# Altium schematic sheet Audio_Codecs_v1.SchDoc
size A4; SheetNumber: 2; SheetTotal: 13
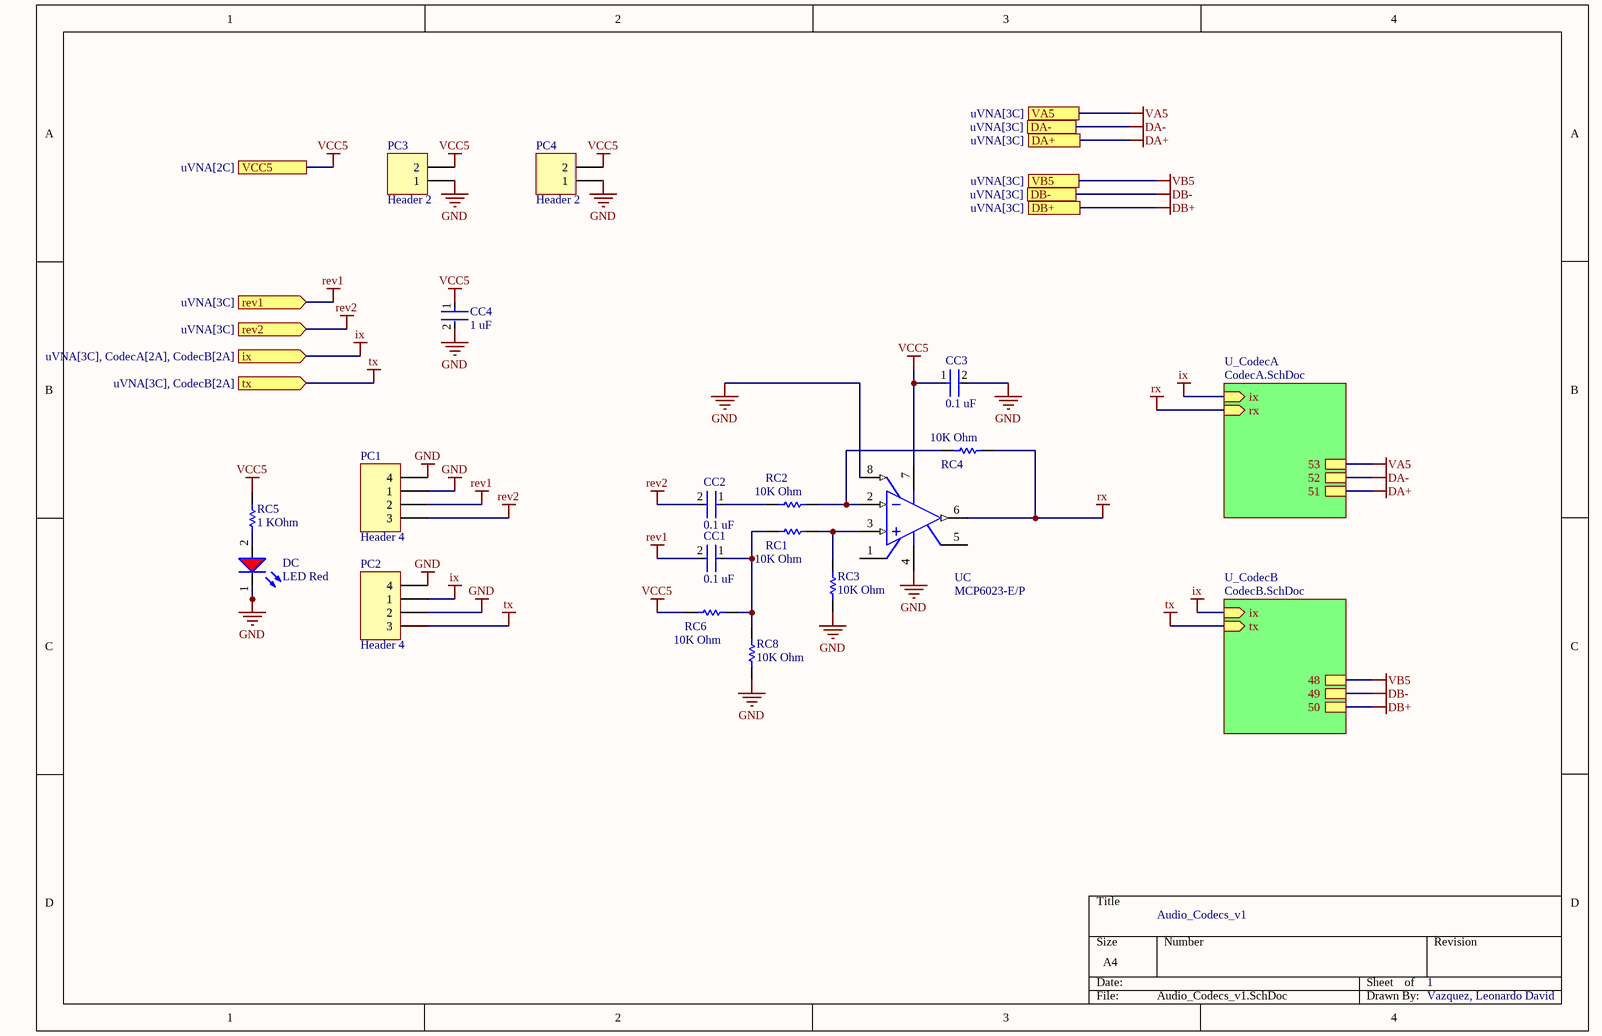
[diagram p0: Audio_Codecs_v1.SchDoc]

## Parts
CC1  0.1 uF  [FP-CC0805-0_85-MFG]
CC2  0.1 uF  [FP-CC0805-0_85-MFG]
CC3  0.1 uF  [FP-CC0805-0_85-MFG]
CC4  1 uF  [FP-CC0805-0_85-MFG]
DC  LED Red  [WL-SMCW_0805_150080xx75000]
PC1  Header 4  [HDR1X4]
PC2  Header 4  [HDR1X4]
PC3  Header 2  [HDR1X2]
PC4  Header 2  [HDR1X2]
RC1  10K Ohm  [RESC2013X60X40ML20T25]
RC2  10K Ohm  [RESC2013X60X40ML20T25]
RC3  10K Ohm  [RESC2013X60X40ML20T25]
RC4  10K Ohm  [RESC2013X60X40ML20T25]
RC5  1 KOhm  [RESC2013X60X40ML20T25]
RC6  10K Ohm  [RESC2013X60X40ML20T25]
RC8  10K Ohm  [RESC2013X60X40ML20T25]
UC  MCP6023-E/P  [PDIP300-P8]

## Sub-sheets
U_CodecA = CodecA.SchDoc: ix (in), rx (in), 51, 52, 53
U_CodecB = CodecB.SchDoc: ix (in), tx (in), 48, 49, 50

## Ports
DA+ (see uVNA[3C]), DA- (see uVNA[3C]), DB+ (see uVNA[3C]), DB- (see uVNA[3C]), ix (in, see uVNA[3C], CodecA[2A], CodecB[2A]), rev1 (in, see uVNA[3C]), rev2 (in, see uVNA[3C]), tx (in, see uVNA[3C], CodecB[2A]), VA5 (see uVNA[3C]), VB5 (see uVNA[3C]), VCC5 (see uVNA[2C])

## Nets
DA+: port DA+, sheet U_CodecA/51
DA-: port DA-, sheet U_CodecA/52
DB+: port DB+, sheet U_CodecB/50
DB-: port DB-, sheet U_CodecB/49
GND: CC3.2 CC4.2 DC.1(K) PC1.1 PC1.4 PC2.2 PC2.4 PC3.1 PC4.1 RC3.2 RC8.2 UC.4(VSS) UC.8(~{CS})
ix: PC2.1 ; port ix, sheet U_CodecA/ix, sheet U_CodecB/ix
rev1: CC1.2 PC1.2 ; port rev1
rev2: CC2.2 PC1.3 ; port rev2
rx: RC4.1 UC.6(VOUT) ; sheet U_CodecA/rx
tx: PC2.3 ; port tx, sheet U_CodecB/tx
VA5: port VA5, sheet U_CodecA/53
VB5: port VB5, sheet U_CodecB/48
VCC5: CC3.1 CC4.1 PC3.2 PC4.2 RC5.2 RC6.2 UC.7(VDD) ; port VCC5
NetCC1_1: CC1.1 RC1.2 RC6.1 RC8.1
NetCC2_1: CC2.1 RC2.2
NetDC_2: DC.2(A) RC5.1
NetRC1_1: RC1.1 RC3.1 UC.3(VIN+)
NetRC2_1: RC2.1 RC4.2 UC.2(VIN-)

Not connected (* = marked no-connect by the designer): UC 1(NC) 5(VREF)

## Notes on the sheet
- Audio_Codecs_v1
- 1
- Vazquez, Leonardo David

## Library data of the parts
CC1-CC4 = CMP-2100-03606-3: CAP CER 0.1UF 50V X7R 0805; Manufacturer Part Number: CC0805KRX7R9BB104; Manufacturer: Yageo; Tolerance: 0.1; Capacitance: 100 nF; Value: 100 nF; Device Class L1: Passive Components; ComponentLink2Description: Datasheet; Package: CC0805-0.85; Digikey Description: CAP CER 0.1UF 50V X7R 0805; Device Class L3: Ceramic Capacitors; Temperature: -30°C to +85°C; Temperature Characteristic: X7R; Voltage Rating: 50 V; Height: 0.95mm; RoHS: TRUE; Ipc Land Pattern Name: CAPC200125X85; Device Class L2: Capacitors; Category: Cap; Temperature Range Low: -30°C; Temperature Range High: +85°C; Material: Ceramic; Mouser Description: Multilayer Ceramic Capacitors MLCC - SMD/SMT 100nF 50V X7R 10%; Footprint Url: http://www.yageo.com/exep/pages/download/literatures/UPY-C_GEN_24.pdf; Automotive: No; Octopart: https://octopart.com/cc0805krx7r9bb104-yageo-192993; Lead Free: Yes; ComponentLink2URL: http://www.yageo.com/documents/recent/UPY-GPHC_Y5V_6.3V-to-50V_8.pdf
DC = CMP-1426-00011-2: NexarPartId: 29717781; Peak Wavelength: 630nm; Wavelength: 625nm; Viewing Angle: 140°; Test Current: 20mA; Forward Voltage: 2V; Forward Current: 100mA; Lens Style: Clear, Rectangular; Luminous Intensity: 150mcd; Max Reverse Voltage (DC): 5V; Length: 2mm; Case Code (Imperial): 0805; RoHS: Compliant; Max Operating Temperature: 85°C; Height: 700µm; Packaging: Tape and Reel; Color: Red; Case/Package: 0805; REACH SVHC: Unknown; Dominant Wavelength: 625nm; Min Operating Temperature: -40°C; Case Code (Metric): 2012; Mount: Surface Mount; Width: 1.25mm
PC1 PC2 = Header 4: Header, 4-Pin; LatestRevisionDate: 17-Jul-2002; LatestRevisionNote: Re-released for DXP Platform.; Publisher: Altium Limited
PC3 PC4 = Header 2: Header, 2-Pin; LatestRevisionDate: 17-Jul-2002; LatestRevisionNote: Re-released for DXP Platform.; Publisher: Altium Limited
RC1-RC6 RC8 = CMP-2001-00580-1: Manufacturer: Panasonic; Part Number: ERA6AEB101V
UC = CMP-0187-00677-2: None; Input Bias Current: 1pA; Input Offset Voltage (Vos): 250uV; Number of Circuits: 1; Supply Current: 1mA; Output Current per Channel: 30mA; Output Current: 22mA; Voltage Gain: 110dB; Min Supply Voltage: 2.5V; Gain Bandwidth Product: 10MHz; Common Mode Rejection Ratio: 70dB; Amplifier Type: GENERAL PURPOSE; Slew Rate: 7V/µs; Max Supply Voltage: 5.5V; Power Supply Rejection Ratio (PSRR): 74dB; Mount: Through Hole; Height: 0.195inch; Case/Package: PDIP; Nominal Supply Current: 1mA; Length: 10.16mm; Number of Elements: 1; REACH SVHC: No SVHC; Lead Free: Lead Free; Radiation Hardening: No; Package Quantity: 60; Packaging: Rail/Tube; Number of Amplifiers: 1; Min Operating Temperature: -40°C; Max Operating Temperature: 125°C; Technology: CMOS; Operating Supply Current: 1mA; Number of Pins: 8; RoHS Compliant: Yes; Unity Gain Bandwidth Product: 10MHz; Width: 0.28inch; Bandwidth: 10MHz; Number of Channels: 1